# EAGLE schematic front-panel-controller (EAGLE 5.11)

## Sheet 1 of 4
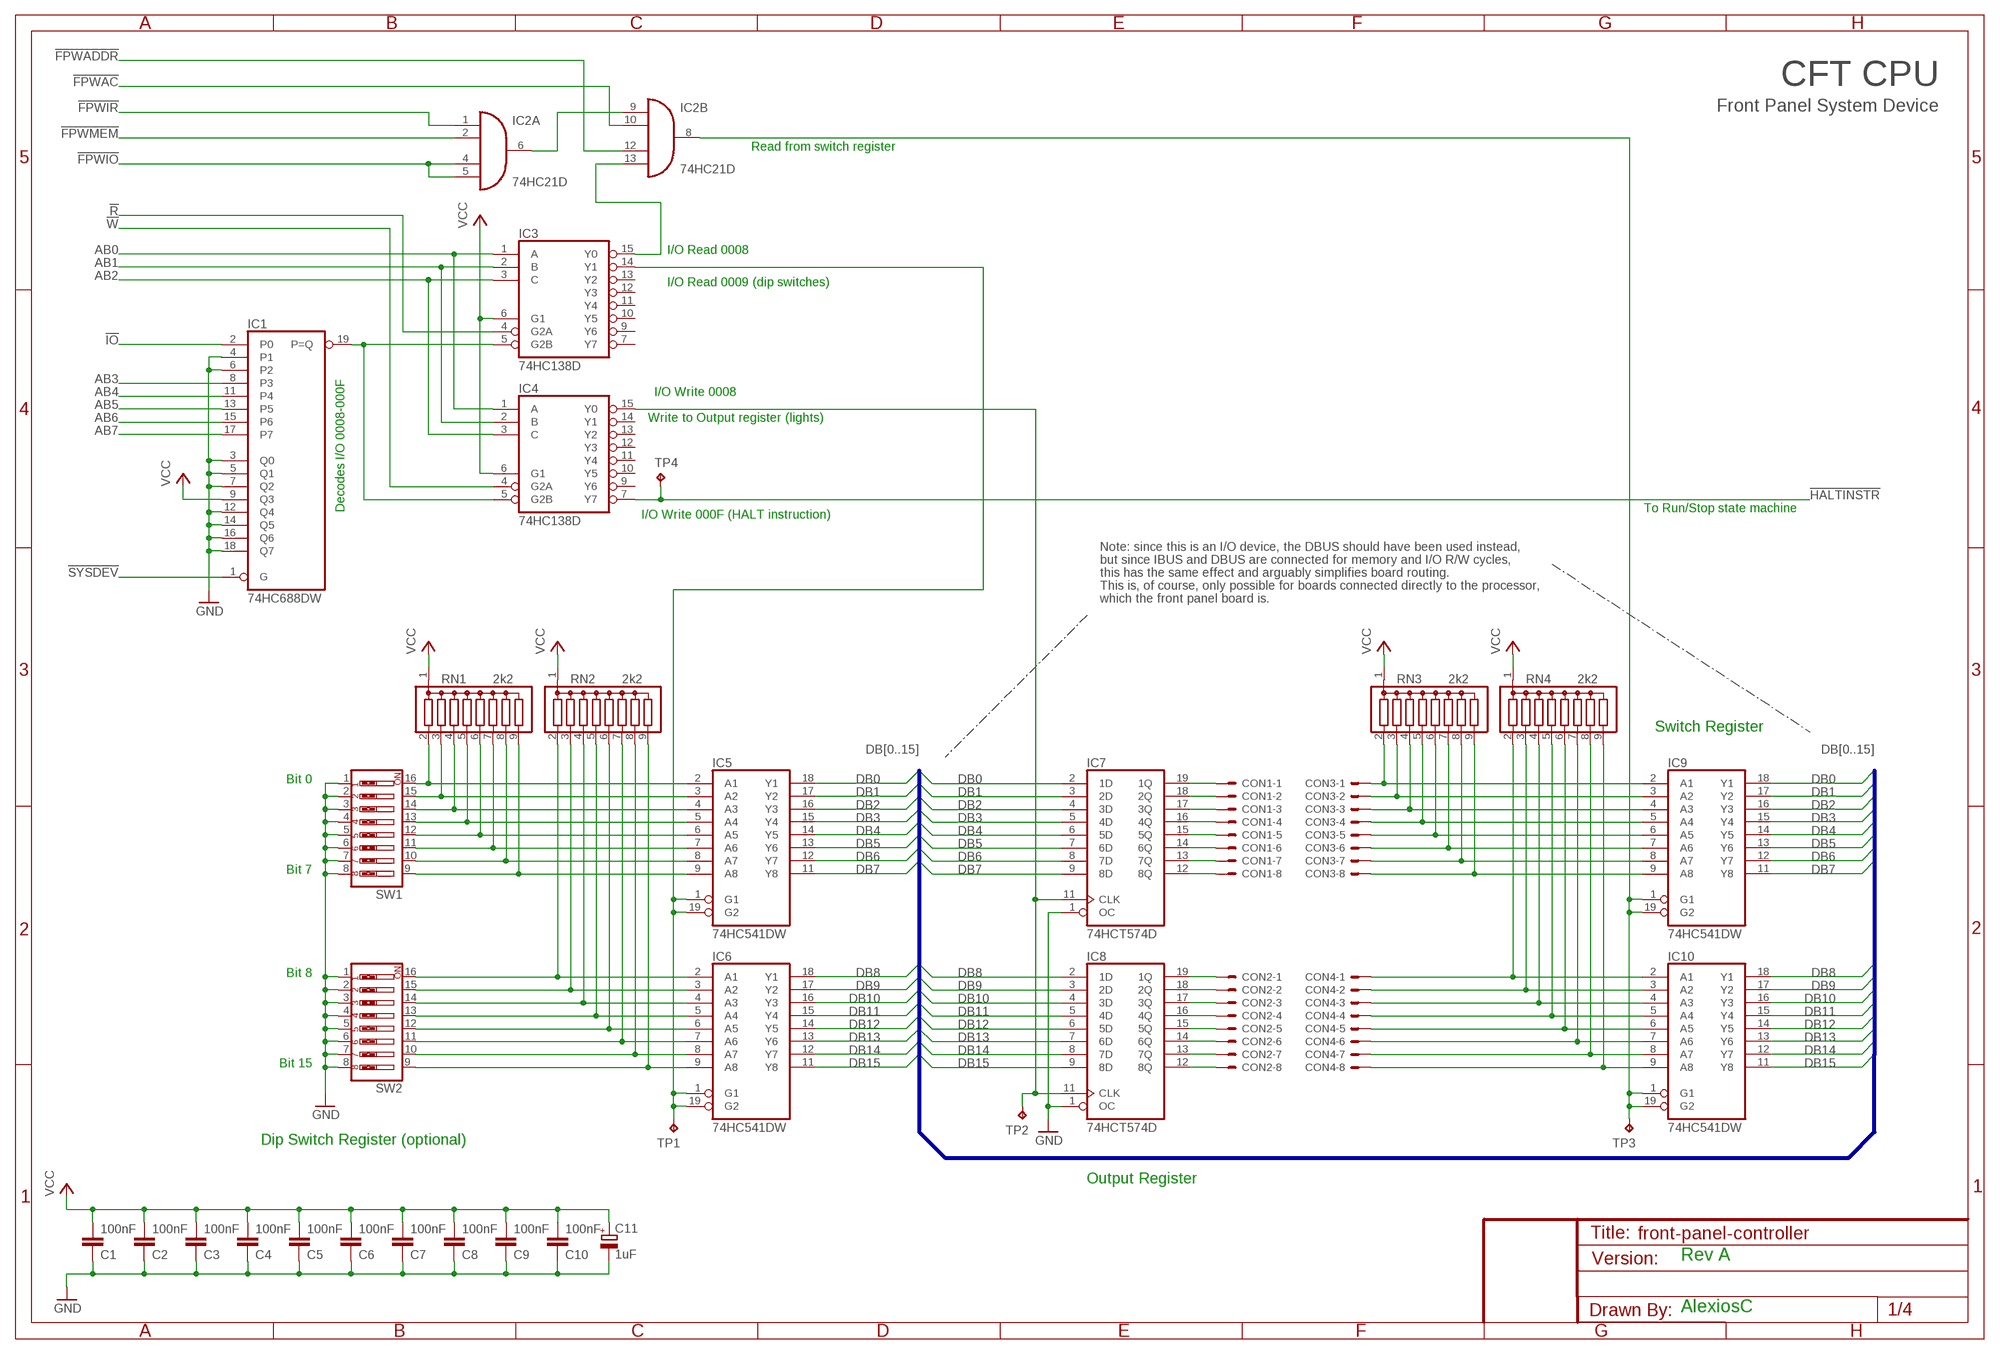
[diagram p0: schematic, sheet 1]

### Parts
C1  100nF  C-EUC0805  [C0805]
C2  100nF  C-EUC0805  [C0805]
C3  100nF  C-EUC0805  [C0805]
C4  100nF  C-EUC0805  [C0805]
C5  100nF  C-EUC0805  [C0805]
C6  100nF  C-EUC0805  [C0805]
C7  100nF  C-EUC0805  [C0805]
C8  100nF  C-EUC0805  [C0805]
C9  100nF  C-EUC0805  [C0805]
C10  100nF  C-EUC0805  [C0805]
C11  1uF  CPOL-EUE2.5-5  [E2,5-5]
CON1  22-23-2081  [22-23-2081]
CON2  22-23-2081  [22-23-2081]
CON3  22-23-2081  [22-23-2081]
CON4  22-23-2081  [22-23-2081]
IC1  74HC688DW  [SO20W]
IC2  74HC21D  [SO14]
IC3  74HC138D  [SO16]
IC4  74HC138D  [SO16]
IC5  74HC541DW  [SO20W]
IC6  74HC541DW  [SO20W]
IC7  74HCT574D  [SO20W]
IC8  74HCT574D  [SO20W]
IC9  74HC541DW  [SO20W]
IC10  74HC541DW  [SO20W]
RN1  2k2  G08R  [SIL9]
RN2  2k2  G08R  [SIL9]
RN3  2k2  G08R  [SIL9]
RN4  2k2  G08R  [SIL9]
SW1  SW_DIP-8  [EDG-08]
SW2  SW_DIP-8  [EDG-08]
TP1  TPPAD1-13  [P1-13]
TP2  TPPAD1-13  [P1-13]
TP3  TPPAD1-13  [P1-13]
TP4  TPPAD1-13  [P1-13]

### Nets
!CLKOREG: IC4.15(Y0) IC7.11(CLK) IC8.11(CLK) TP2.TP
!FPWAC: IC2.10(B:I1) ; also sheet 3,4
!FPWADDR: IC2.12(B:I2) ; also sheet 3,4
!FPWIO: IC2.4(A:I2) IC2.5(A:I3) ; also sheet 3,4
!FPWIR: IC2.1(A:I0) ; also sheet 3,4
!FPWMEM: IC2.2(A:I1) ; also sheet 3,4
!HALTINSTR: IC4.7(Y7) TP4.TP ; also sheet 2
!IO: IC1.2(P0) ; also sheet 3,4
!R: IC3.4(G2A) ; also sheet 3,4
!RDPSW: IC3.14(Y1) IC5.1(G1) IC5.19(G2) IC6.1(G1) IC6.19(G2) TP1.TP
!RSW: IC2.8(B:O) IC9.1(G1) IC9.19(G2) IC10.1(G1) IC10.19(G2) TP3.TP
!SYSDEV: IC1.1(G) ; also sheet 4
!W: IC4.4(G2A) ; also sheet 3,4
AB0: IC3.1(A) IC4.1(A) ; also sheet 4
AB1: IC3.2(B) IC4.2(B) ; also sheet 4
AB2: IC3.3(C) IC4.3(C) ; also sheet 4
AB3: IC1.8(P3) ; also sheet 4
AB4: IC1.11(P4) ; also sheet 4
AB5: IC1.13(P5) ; also sheet 4
AB6: IC1.15(P6) ; also sheet 4
AB7: IC1.17(P7) ; also sheet 4
DB0: IC5.18(Y1) IC7.2(1D) IC9.18(Y1) ; also sheet 4
DB1: IC5.17(Y2) IC7.3(2D) IC9.17(Y2) ; also sheet 4
DB2: IC5.16(Y3) IC7.4(3D) IC9.16(Y3) ; also sheet 4
DB3: IC5.15(Y4) IC7.5(4D) IC9.15(Y4) ; also sheet 4
DB4: IC5.14(Y5) IC7.6(5D) IC9.14(Y5) ; also sheet 4
DB5: IC5.13(Y6) IC7.7(6D) IC9.13(Y6) ; also sheet 4
DB6: IC5.12(Y7) IC7.8(7D) IC9.12(Y7) ; also sheet 4
DB7: IC5.11(Y8) IC7.9(8D) IC9.11(Y8) ; also sheet 4
DB8: IC6.18(Y1) IC8.2(1D) IC10.18(Y1) ; also sheet 4
DB9: IC6.17(Y2) IC8.3(2D) IC10.17(Y2) ; also sheet 4
DB10: IC6.16(Y3) IC8.4(3D) IC10.16(Y3) ; also sheet 4
DB11: IC6.15(Y4) IC8.5(4D) IC10.15(Y4) ; also sheet 4
DB12: IC6.14(Y5) IC8.6(5D) IC10.14(Y5) ; also sheet 4
DB13: IC6.13(Y6) IC8.7(6D) IC10.13(Y6) ; also sheet 4
DB14: IC6.12(Y7) IC8.8(7D) IC10.12(Y7) ; also sheet 4
DB15: IC6.11(Y8) IC8.9(8D) IC10.11(Y8) ; also sheet 4
GND: C1.1 C2.1 C3.1 C4.1 C5.1 C6.1 C7.1 C8.1 C9.1 C10.1 C11.- IC1.3(Q0) IC1.4(P1) IC1.5(Q1) IC1.6(P2) IC1.7(Q2) IC1.12(Q4) IC1.14(Q5) IC1.16(Q6) IC1.18(Q7) IC7.1(OC) IC8.1(OC) SW1.1 SW1.2 SW1.3 SW1.4 SW1.5 SW1.6 SW1.7 SW1.8 SW2.1 SW2.2 SW2.3 SW2.4 SW2.5 SW2.6 SW2.7 SW2.8 ; also sheet 2,3,4
N$1: IC5.2(A1) RN1.2 SW1.16
N$2: IC5.3(A2) RN1.3 SW1.15
N$3: IC5.4(A3) RN1.4 SW1.14
N$4: IC5.5(A4) RN1.5 SW1.13
N$5: IC5.6(A5) RN1.6 SW1.12
N$6: IC5.7(A6) RN1.7 SW1.11
N$7: IC5.8(A7) RN1.8 SW1.10
N$8: IC5.9(A8) RN1.9 SW1.9
N$9: IC6.2(A1) RN2.2 SW2.16
N$10: IC6.3(A2) RN2.3 SW2.15
N$11: IC6.4(A3) RN2.4 SW2.14
N$12: IC6.5(A4) RN2.5 SW2.13
N$13: IC6.6(A5) RN2.6 SW2.12
N$14: IC6.7(A6) RN2.7 SW2.11
N$15: IC6.8(A7) RN2.8 SW2.10
N$16: IC6.9(A8) RN2.9 SW2.9
N$22: CON3.1 IC9.2(A1) RN3.2
N$31: IC1.19(P=Q) IC3.5(G2B) IC4.5(G2B)
N$32: IC2.13(B:I3) IC3.15(Y0)
N$48: IC2.6(A:O) IC2.9(B:I0)
N$49: CON1.1 IC7.19(1Q)
N$50: CON1.2 IC7.18(2Q)
N$51: CON1.3 IC7.17(3Q)
N$52: CON1.4 IC7.16(4Q)
N$53: CON1.5 IC7.15(5Q)
N$54: CON1.6 IC7.14(6Q)
N$56: CON1.7 IC7.13(7Q)
N$62: CON1.8 IC7.12(8Q)
N$63: CON2.1 IC8.19(1Q)
N$64: CON2.2 IC8.18(2Q)
N$65: CON2.3 IC8.17(3Q)
N$66: CON2.4 IC8.16(4Q)
N$67: CON2.5 IC8.15(5Q)
N$68: CON2.6 IC8.14(6Q)
N$69: CON2.7 IC8.13(7Q)
N$70: CON2.8 IC8.12(8Q)
N$71: CON3.2 IC9.3(A2) RN3.3
N$72: CON3.3 IC9.4(A3) RN3.4
N$73: CON3.4 IC9.5(A4) RN3.5
N$74: CON3.5 IC9.6(A5) RN3.6
N$75: CON3.6 IC9.7(A6) RN3.7
N$76: CON3.7 IC9.8(A7) RN3.8
N$78: CON3.8 IC9.9(A8) RN3.9
N$84: CON4.1 IC10.2(A1) RN4.2
N$85: CON4.2 IC10.3(A2) RN4.3
N$86: CON4.3 IC10.4(A3) RN4.4
N$87: CON4.4 IC10.5(A4) RN4.5
N$88: CON4.5 IC10.6(A5) RN4.6
N$89: CON4.6 IC10.7(A6) RN4.7
N$90: CON4.7 IC10.8(A7) RN4.8
N$91: CON4.8 IC10.9(A8) RN4.9
VCC: C1.2 C2.2 C3.2 C4.2 C5.2 C6.2 C7.2 C8.2 C9.2 C10.2 C11.+ IC1.9(Q3) IC3.6(G1) IC4.6(G1) RN1.1 RN2.1 RN3.1 RN4.1 ; also sheet 2,3,4
Unconnected: IC3.7(Y7) IC3.9(Y6) IC3.10(Y5) IC3.11(Y4) IC3.12(Y3) IC3.13(Y2) IC4.9(Y6) IC4.10(Y5) IC4.11(Y4) IC4.12(Y3) IC4.13(Y2) IC4.14(Y1)

### Buses
DB[0..15]

### Notes on the sheet
- CFT CPU
- Front Panel System Device
- Read from switch register
- I/O Read 0008
- I/O Read 0009 (dip switches)
- I/O Write 0008
- Write to Output register (lights)
- Decodes I/O 0008-000F | To Run/Stop state machine
- I/O Write 000F (HALT instruction)
- Note: since this is an I/O device, the DBUS should have been used instead,
- but since IBUS and DBUS are connected for memory and I/O R/W cycles,
- this has the same effect and arguably simplifies board routing.
- This is, of course, only possible for boards connected directly to the processor,
- which the front panel board is.
- Switch Register
- Bit 0
- Bit 7
- Bit 8
- Bit 15
- Dip Switch Register (optional)
- Output Register
- Rev A
- AlexiosC

## Sheet 2 of 4
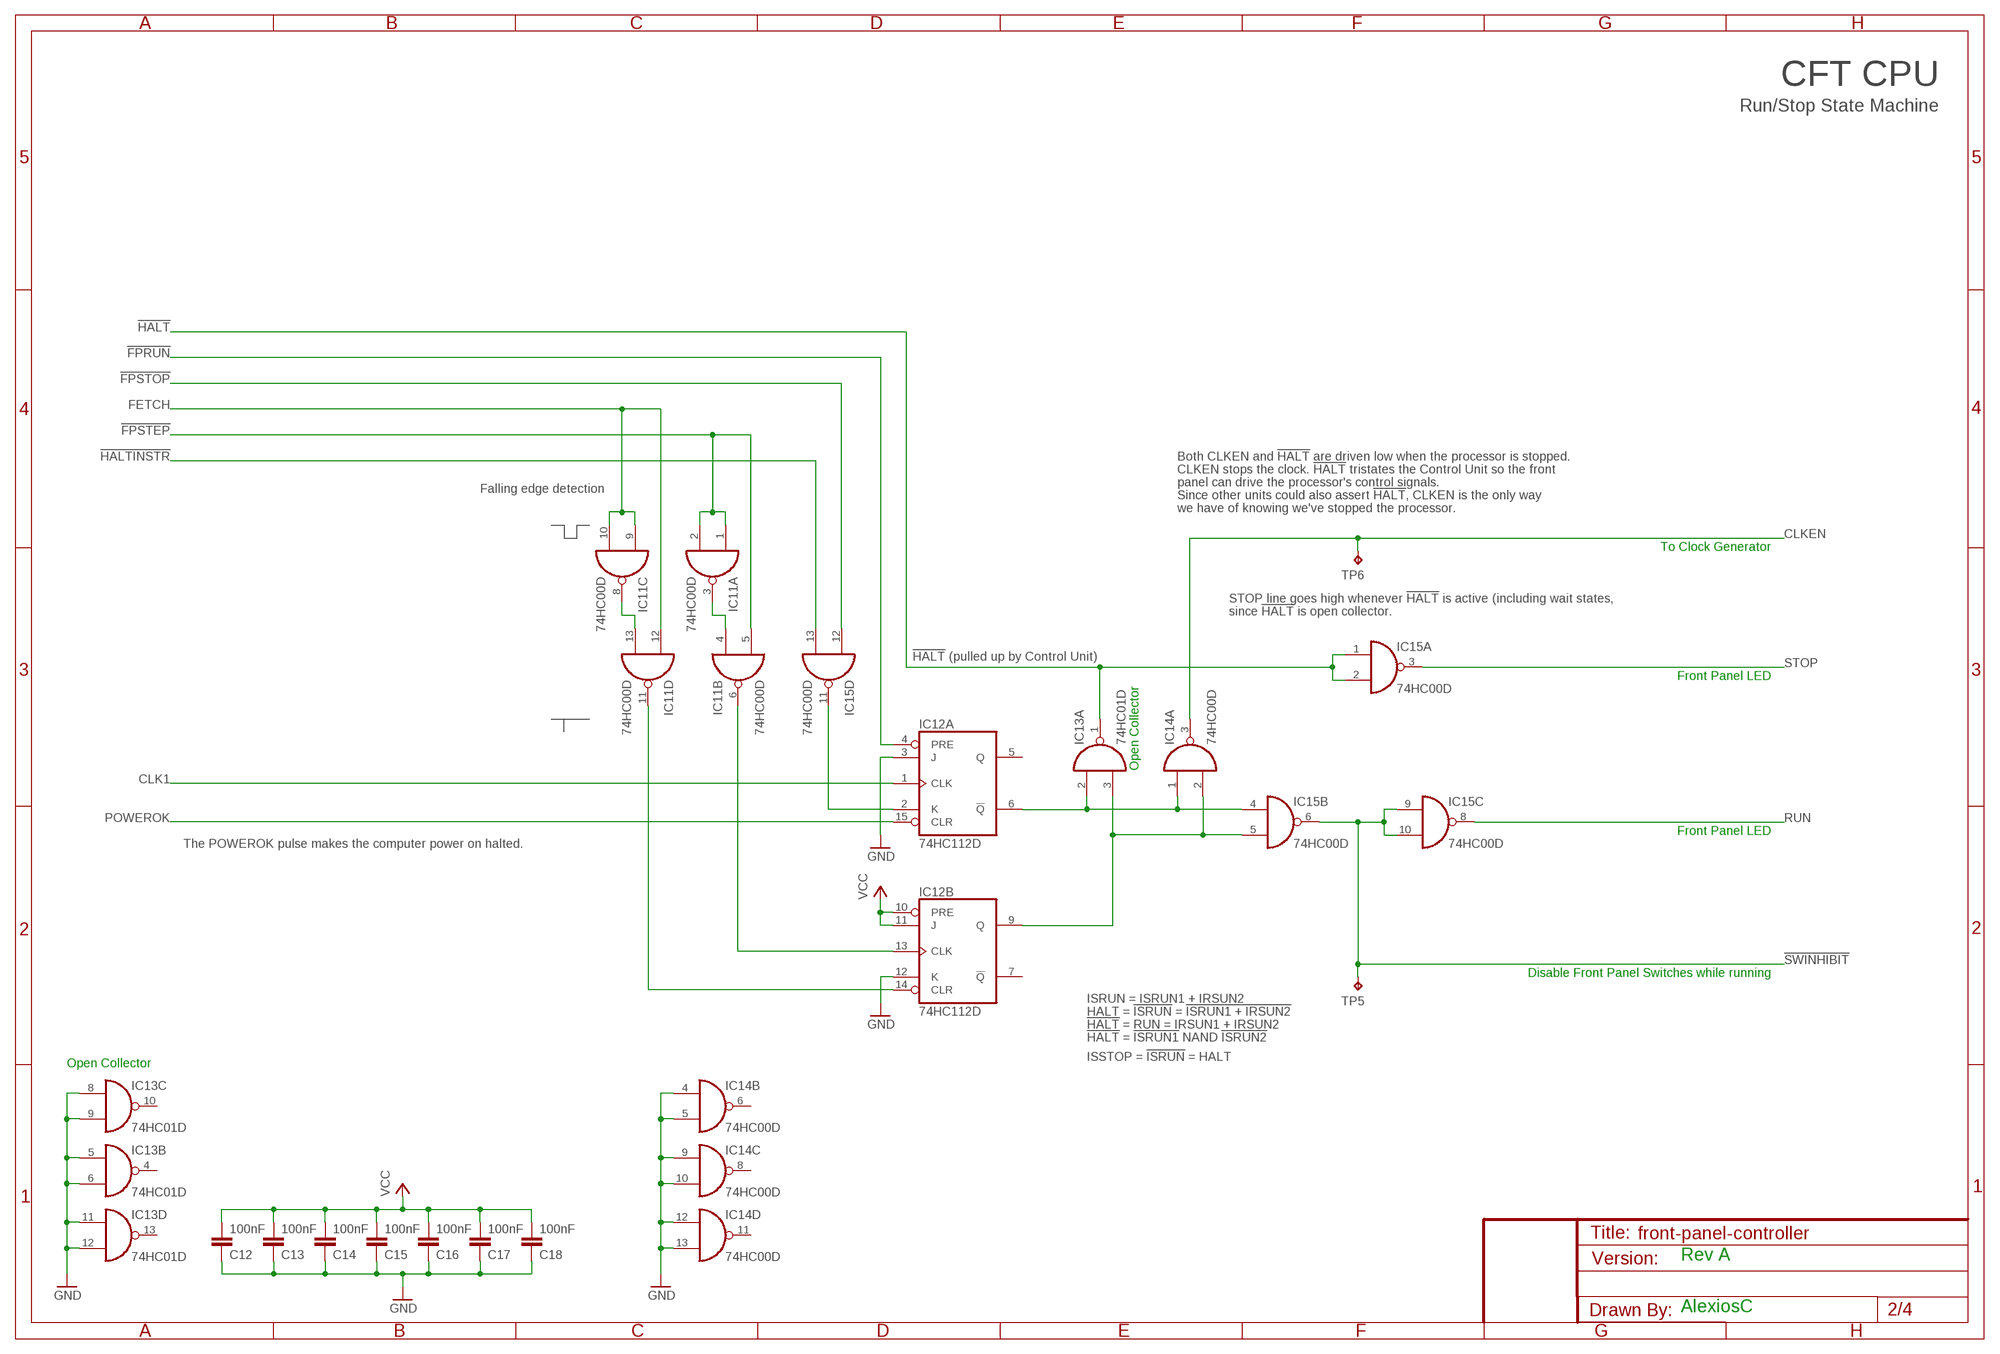
[diagram p1: schematic, sheet 2]

### Parts
C12  100nF  C-EUC0805  [C0805]
C13  100nF  C-EUC0805  [C0805]
C14  100nF  C-EUC0805  [C0805]
C15  100nF  C-EUC0805  [C0805]
C16  100nF  C-EUC0805  [C0805]
C17  100nF  C-EUC0805  [C0805]
C18  100nF  C-EUC0805  [C0805]
IC11  74HC00D  [SO14]
IC12  74HC112D  [SO16]
IC13  74HC01D  [SO14]
IC14  74HC00D  [SO14]
IC15  74HC00D  [SO14]
TP5  TPPAD1-13  [P1-13]
TP6  TPPAD1-13  [P1-13]

### Nets
!FPRUN: IC12.4(A:PRE) ; also sheet 4
!FPSTEP: IC11.1(A:I0) IC11.2(A:I1) IC11.5(B:I1) ; also sheet 4
!FPSTOP: IC15.12(D:I0) ; also sheet 4
!HALT: IC13.1(A:O) IC15.1(A:I0) IC15.2(A:I1) ; also sheet 4
!HALTINSTR: IC15.13(D:I1) ; also sheet 1
!SWINHIBIT: IC15.6(B:O) IC15.9(C:I0) IC15.10(C:I1) TP5.TP ; also sheet 4
CLK1: IC12.1(A:CLK) ; also sheet 4
CLKEN: IC14.3(A:O) TP6.TP ; also sheet 4
FETCH: IC11.9(C:I0) IC11.10(C:I1) IC11.12(D:I0) ; also sheet 4
GND: C12.1 C13.1 C14.1 C15.1 C16.1 C17.1 C18.1 IC12.3(A:J) IC12.12(B:K) IC13.5(B:I0) IC13.6(B:I1) IC13.8(C:I0) IC13.9(C:I1) IC13.11(D:I0) IC13.12(D:I1) IC14.4(B:I0) IC14.5(B:I1) IC14.9(C:I0) IC14.10(C:I1) IC14.12(D:I0) IC14.13(D:I1) ; also sheet 1,3,4
N$39: IC11.3(A:O) IC11.4(B:I0)
N$42: IC11.8(C:O) IC11.13(D:I1)
N$43: IC12.2(A:K) IC15.11(D:O)
N$44: IC11.11(D:O) IC12.14(B:CLR)
N$45: IC12.6(A:!Q) IC13.2(A:I0) IC14.1(A:I0) IC15.4(B:I0)
N$46: IC12.9(B:Q) IC13.3(A:I1) IC14.2(A:I1) IC15.5(B:I1)
N$47: IC11.6(B:O) IC12.13(B:CLK)
POWEROK: IC12.15(A:CLR) ; also sheet 4
RUN: IC15.8(C:O) ; also sheet 3,4
STOP: IC15.3(A:O) ; also sheet 4
VCC: C12.2 C13.2 C14.2 C15.2 C16.2 C17.2 C18.2 IC12.10(B:PRE) IC12.11(B:J) ; also sheet 1,3,4
Unconnected: IC12.5(A:Q) IC12.7(B:!Q) IC13.4(B:O) IC13.10(C:O) IC13.13(D:O) IC14.6(B:O) IC14.8(C:O) IC14.11(D:O)

### Notes on the sheet
- CFT CPU
- Run/Stop State Machine
- Both CLKEN and !HALT! are driven low when the processor is stopped.
- CLKEN stops the clock. !HALT! tristates the Control Unit so the front
- panel can drive the processor's control signals.
- Falling edge detection
- Since other units could also assert !HALT!, CLKEN is the only way
- we have of knowing we've stopped the processor.
- To Clock Generator
- STOP line goes high whenever !HALT! is active (including wait states,
- since !HALT! is open collector.
- !HALT! (pulled up by Control Unit)
- Front Panel LED
- Open Collector
- Front Panel LED
- The POWEROK pulse makes the computer power on halted.
- Disable Front Panel Switches while running
- ISRUN = ISRUN1 + IRSUN2
- HALT = !ISRUN! = !ISRUN1 + IRSUN2!
- !HALT! = RUN = IRSUN1 + IRSUN2
- !HALT! = !ISRUN1! NAND !ISRUN2!
- ISSTOP = !ISRUN! = HALT
- Open Collector
- Rev A
- AlexiosC

## Sheet 3 of 4
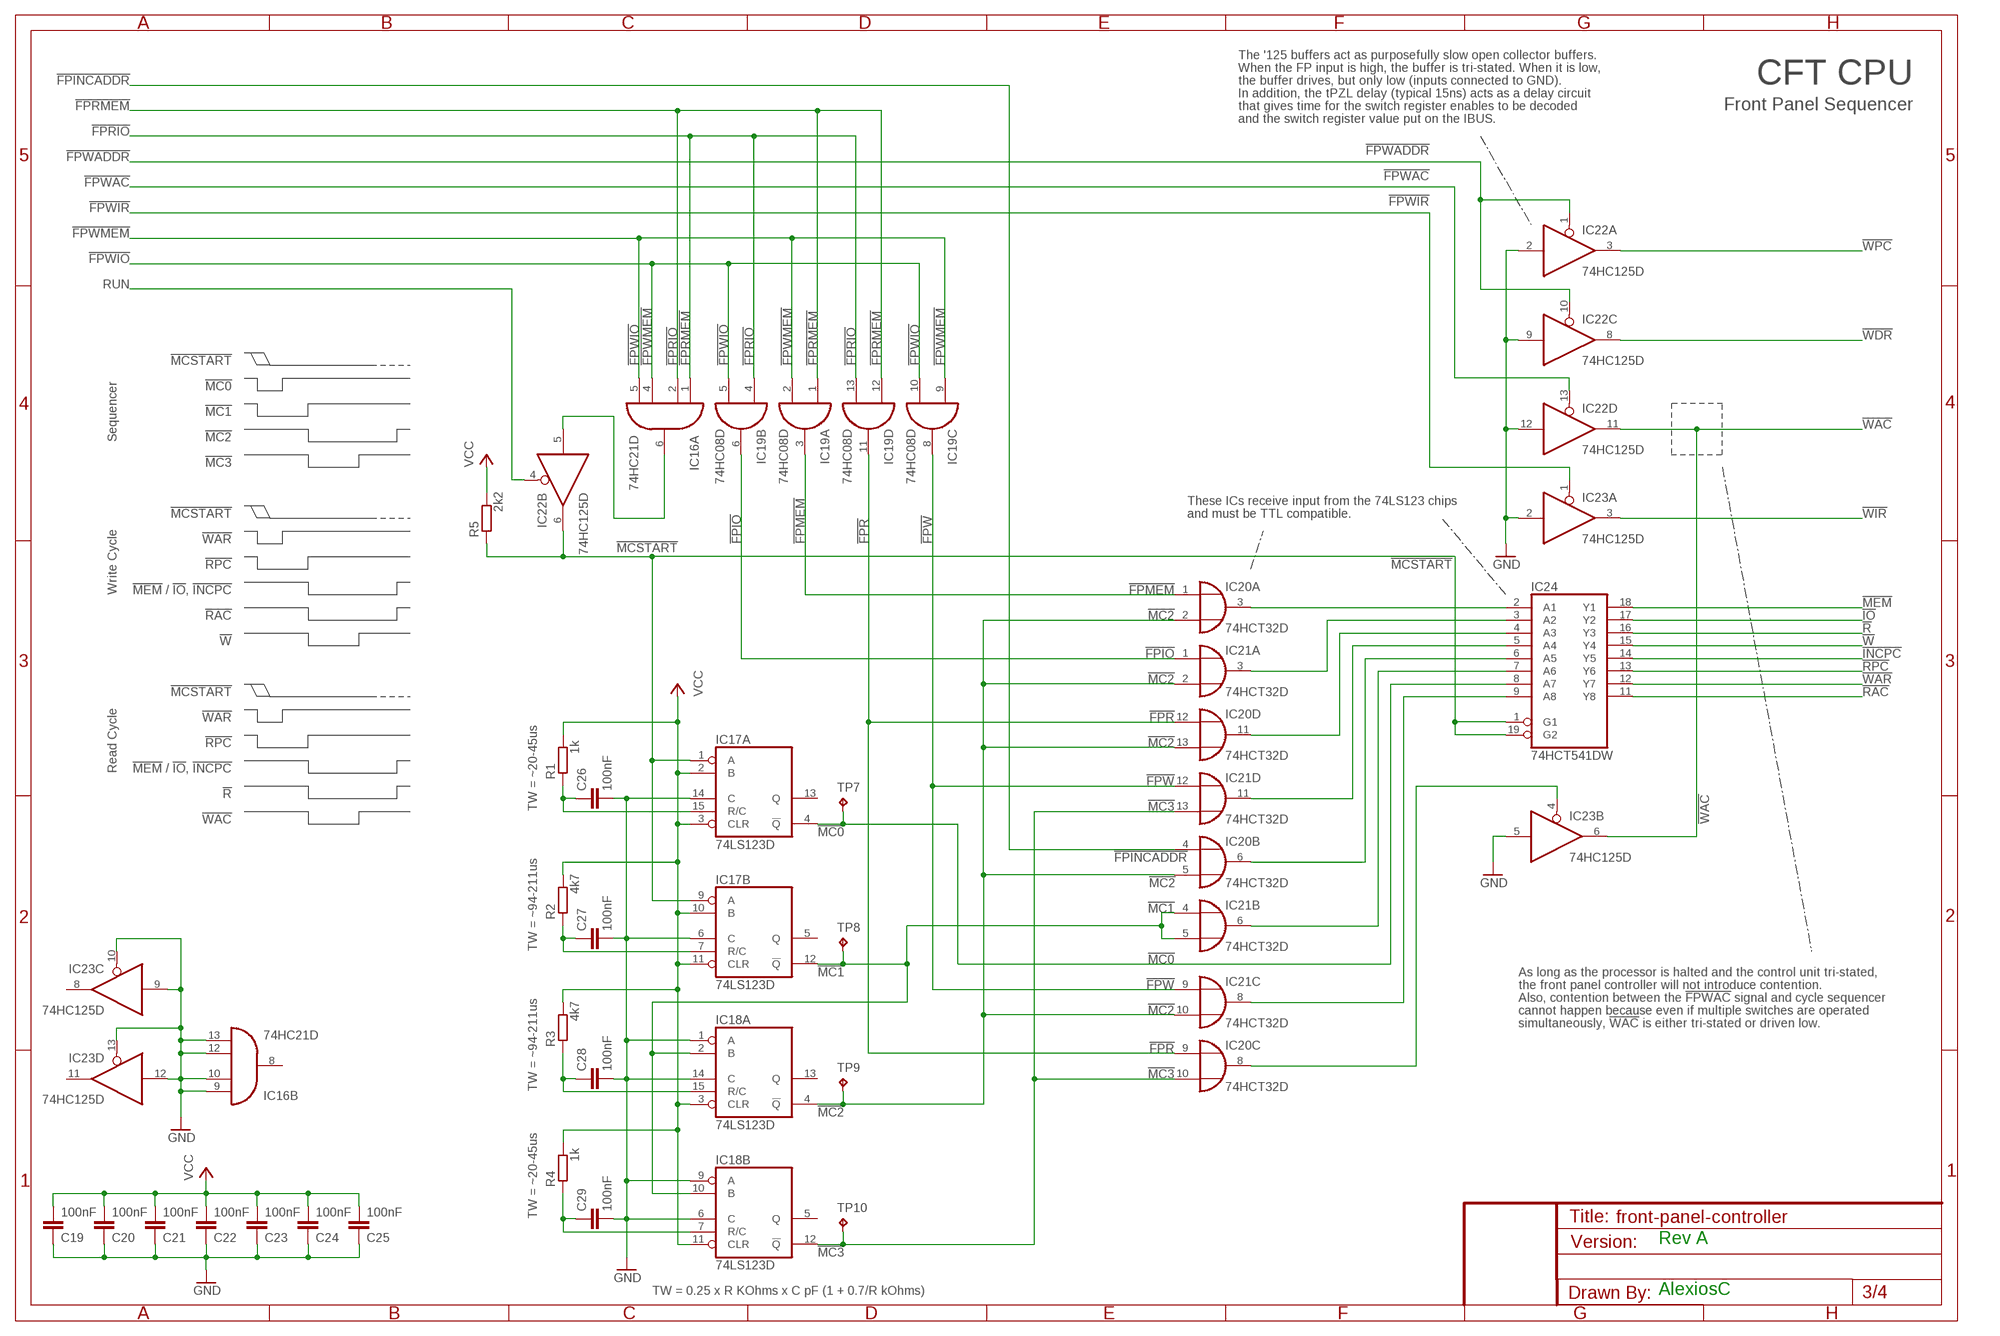
[diagram p2: schematic, sheet 3]

### Parts
C19  100nF  C-EUC0805  [C0805]
C20  100nF  C-EUC0805  [C0805]
C21  100nF  C-EUC0805  [C0805]
C22  100nF  C-EUC0805  [C0805]
C23  100nF  C-EUC0805  [C0805]
C24  100nF  C-EUC0805  [C0805]
C25  100nF  C-EUC0805  [C0805]
C26  100nF  C-EUC0805  [C0805]
C27  100nF  C-EUC0805  [C0805]
C28  100nF  C-EUC0805  [C0805]
C29  100nF  C-EUC0805  [C0805]
IC16  74HC21D  [SO14]
IC17  74LS123D  [SO16]
IC18  74LS123D  [SO16]
IC19  74HC08D  [SO14]
IC20  74HCT32D  [SO14]
IC21  74HCT32D  [SO14]
IC22  74HC125D  [SO14]
IC23  74HC125D  [SO14]
IC24  74HCT541DW  [SO20W]
R1  1k  R-EU_R0805  [R0805]
R2  4k7  R-EU_R0805  [R0805]
R3  4k7  R-EU_R0805  [R0805]
R4  1k  R-EU_R0805  [R0805]
R5  2k2  R-EU_R0805  [R0805]
TP7  TPPAD1-13  [P1-13]
TP8  TPPAD1-13  [P1-13]
TP9  TPPAD1-13  [P1-13]
TP10  TPPAD1-13  [P1-13]

### Nets
!FPINCADDR: IC20.4(B:I0) ; also sheet 4
!FPIO: IC19.6(B:O) IC21.1(A:I0)
!FPMEM: IC19.3(A:O) IC20.1(A:I0)
!FPR: IC19.11(D:O) IC20.9(C:I0) IC20.12(D:I0)
!FPRIO: IC16.1(A:I0) IC19.4(B:I0) IC19.13(D:I1) ; also sheet 4
!FPRMEM: IC16.2(A:I1) IC19.1(A:I0) IC19.12(D:I0) ; also sheet 4
!FPW: IC19.8(C:O) IC21.9(C:I0) IC21.12(D:I0)
!FPWAC: IC22.13(D:OE) ; also sheet 1,4
!FPWADDR: IC22.1(A:OE) IC22.10(C:OE) ; also sheet 1,4
!FPWIO: IC16.4(A:I2) IC19.5(B:I1) IC19.10(C:I1) ; also sheet 1,4
!FPWIR: IC23.1(A:OE) ; also sheet 1,4
!FPWMEM: IC16.5(A:I3) IC19.2(A:I1) IC19.9(C:I0) ; also sheet 1,4
!INCPC: IC24.14(Y5) ; also sheet 4
!IO: IC24.17(Y2) ; also sheet 1,4
!MC0: IC17.4(A:!Q) IC24.8(A7) TP7.TP
!MC1: IC17.12(B:!Q) IC18.2(A:B) IC18.10(B:B) IC21.4(B:I0) IC21.5(B:I1) TP8.TP
!MC2: IC18.4(A:!Q) IC20.2(A:I1) IC20.5(B:I1) IC20.13(D:I1) IC21.2(A:I1) IC21.10(C:I1) TP9.TP
!MC3: IC18.12(B:!Q) IC20.10(C:I1) IC21.13(D:I1) TP10.TP
!MCSTART: IC17.1(A:A) IC17.9(B:A) IC22.6(B:O) IC24.1(G1) IC24.19(G2) R5.1
!MEM: IC24.18(Y1) ; also sheet 4
!R: IC24.16(Y3) ; also sheet 1,4
!RAC: IC24.11(Y8) ; also sheet 4
!RPC: IC24.13(Y6) ; also sheet 4
!W: IC24.15(Y4) ; also sheet 1,4
!WAC: IC22.11(D:O) IC23.6(B:O) ; also sheet 4
!WAR: IC24.12(Y7) ; also sheet 4
!WDR: IC22.8(C:O) ; also sheet 4
!WIR: IC23.3(A:O) ; also sheet 4
!WPC: IC22.3(A:O) ; also sheet 4
GND: C19.1 C20.1 C21.1 C22.1 C23.1 C24.1 C25.1 C26.2 C27.2 C28.2 C29.2 IC16.9(B:I0) IC16.10(B:I1) IC16.12(B:I2) IC16.13(B:I3) IC17.6(B:C) IC17.14(A:C) IC18.1(A:A) IC18.6(B:C) IC18.9(B:A) IC18.14(A:C) IC22.2(A:I) IC22.9(C:I) IC22.12(D:I) IC23.2(A:I) IC23.5(B:I) IC23.9(C:I) IC23.10(C:OE) IC23.12(D:I) IC23.13(D:OE) ; also sheet 1,2,4
N$17: IC20.8(C:O) IC23.4(B:OE)
N$18: IC16.6(A:O) IC22.5(B:I)
N$59: C26.1 IC17.15(A:R/C) R1.1
N$77: IC21.8(C:O) IC24.9(A8)
N$79: C27.1 IC17.7(B:R/C) R2.1
N$80: C28.1 IC18.15(A:R/C) R3.1
N$81: C29.1 IC18.7(B:R/C) R4.1
N$83: IC20.3(A:O) IC24.2(A1)
N$316: IC20.11(D:O) IC24.4(A3)
N$317: IC21.11(D:O) IC24.5(A4)
N$318: IC20.6(B:O) IC24.6(A5)
N$319: IC21.6(B:O) IC24.7(A6)
N$321: IC21.3(A:O) IC24.3(A2)
RUN: IC22.4(B:OE) ; also sheet 2,4
VCC: C19.2 C20.2 C21.2 C22.2 C23.2 C24.2 C25.2 IC17.2(A:B) IC17.3(A:CLR) IC17.10(B:B) IC17.11(B:CLR) IC18.3(A:CLR) IC18.11(B:CLR) R1.2 R2.2 R3.2 R4.2 R5.2 ; also sheet 1,2,4
Unconnected: IC16.8(B:O) IC17.5(B:Q) IC17.13(A:Q) IC18.5(B:Q) IC18.13(A:Q) IC23.8(C:O) IC23.11(D:O)

### Notes on the sheet
- The '125 buffers act as purposefully slow open collector buffers.
- When the FP input is high, the buffer is tri-stated. When it is low,
- the buffer drives, but only low (inputs connected to GND). | CFT CPU
- In addition, the tPZL delay (typical 15ns) acts as a delay circuit
- that gives time for the switch register enables to be decoded | Front Panel Sequencer
- and the switch register value put on the IBUS.
- Sequencer
- These ICs receive input from the 74LS123 chips
- and must be TTL compatible.
- !WAR
- !RPC
- Write Cycle | !MEM! / !IO!, !INCPC!
- !RAC
- !W
- !WAR
- !RPC
- Read Cycle | !MEM! / !IO!, !INCPC!
- !R
- TW = ~20-45us
- !WAC
- TW = ~94-211us
- As long as the processor is halted and the control unit tri-stated,
- the front panel controller will not introduce contention.
- Also, contention between the !FPWAC! signal and cycle sequencer
- cannot happen because even if multiple switches are operated
- simultaneously, !WAC! is either tri-stated or driven low.
- TW = ~94-211us
- TW = ~20-45us
- Rev A
- TW = 0.25 x R KOhms x C pF (1 + 0.7/R kOhms) | AlexiosC

## Sheet 4 of 4
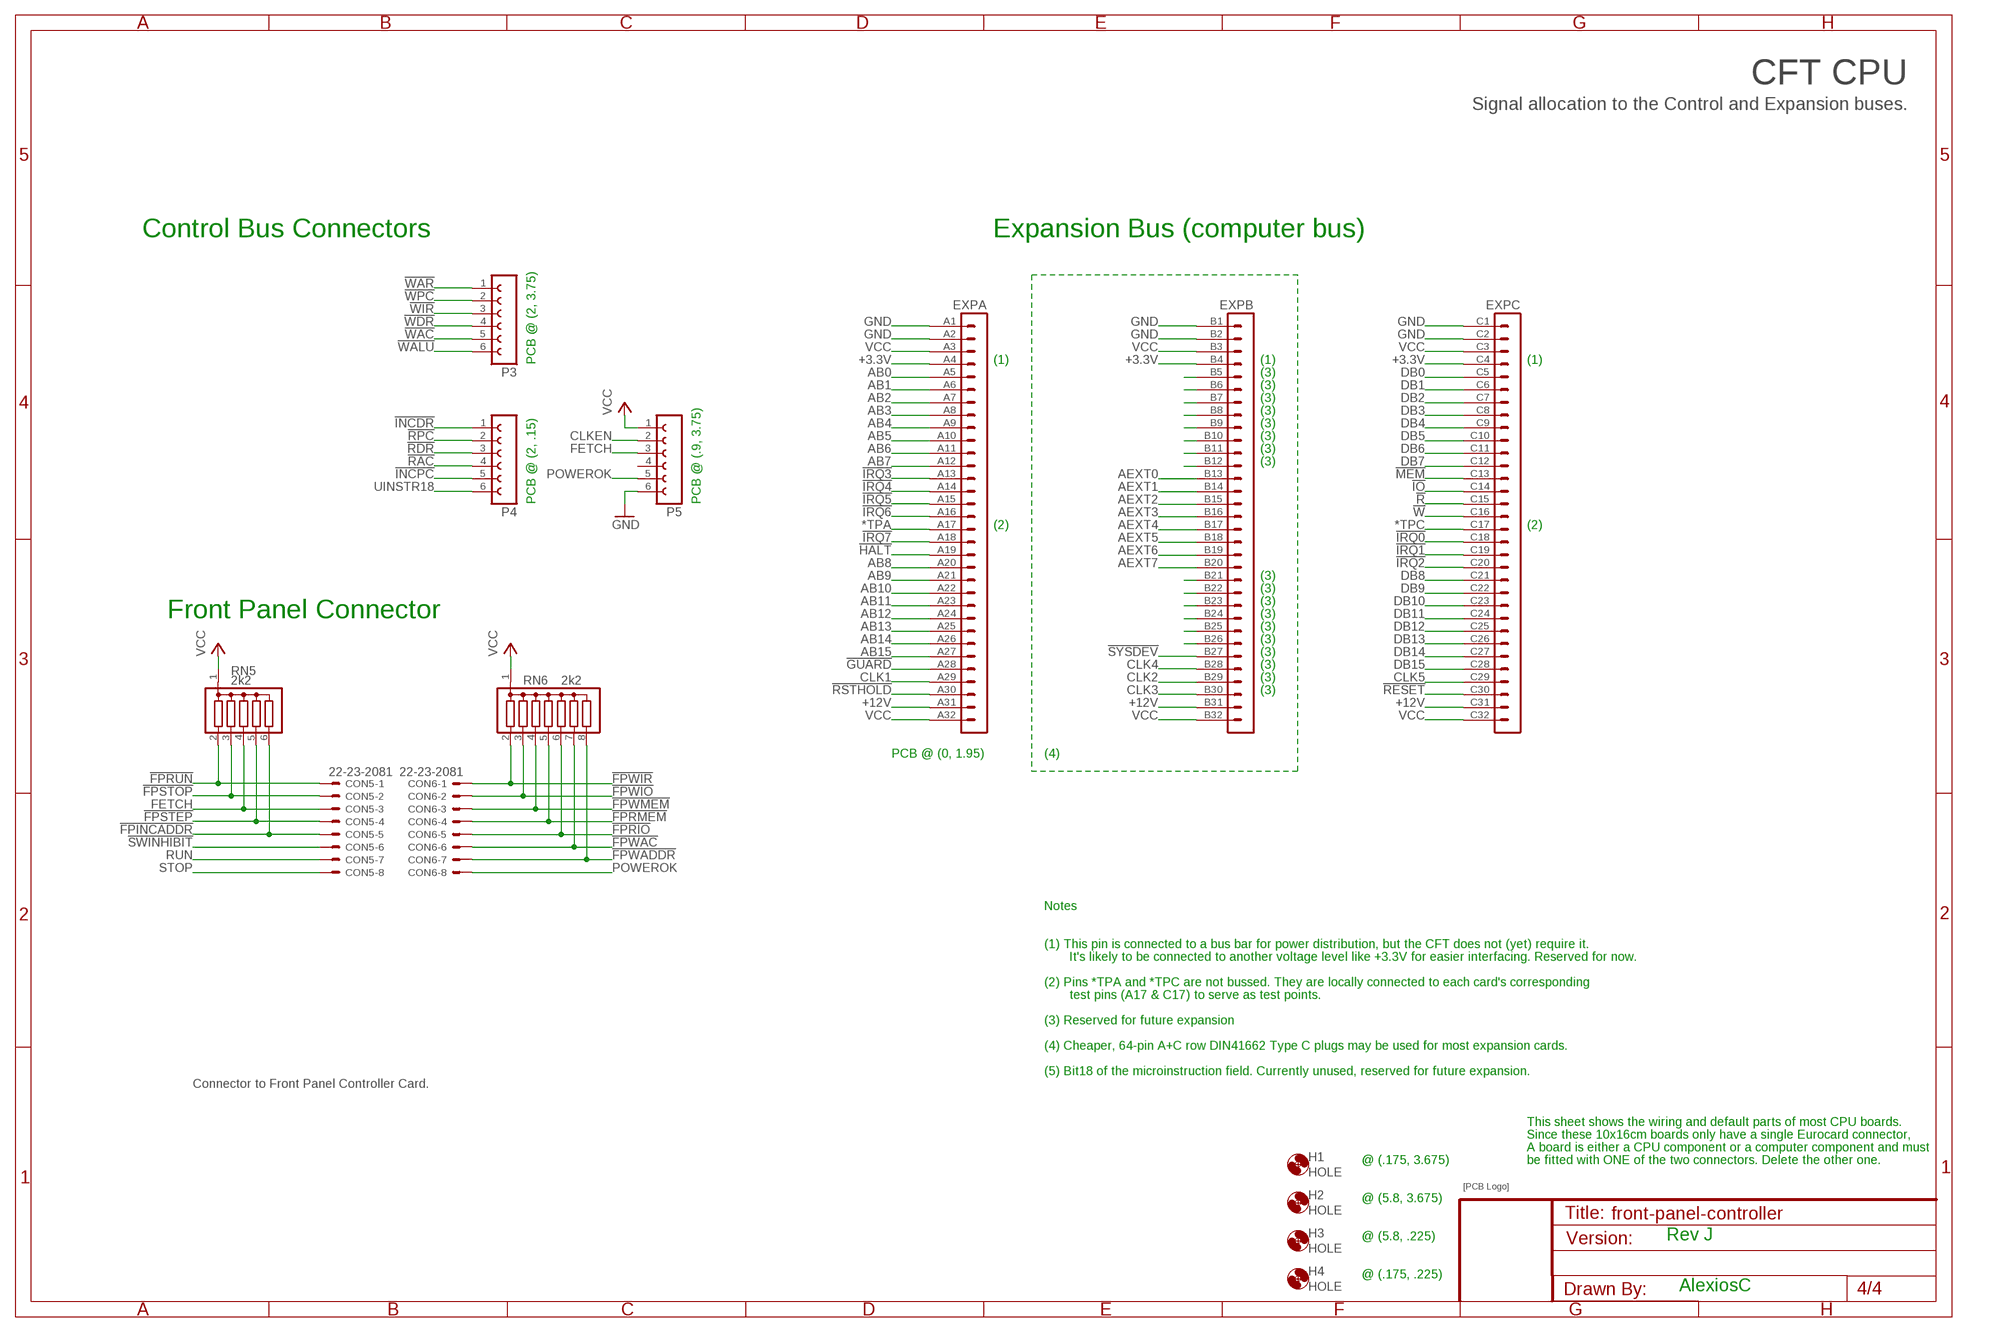
[diagram p3: schematic, sheet 4]

### Parts
CON5  22-23-2081  [22-23-2081]
CON6  22-23-2081  [22-23-2081]
EXP  VG96-3K  [VG96K]
H1  HOLE  [STANDOFF_28_60]
H2  HOLE  [STANDOFF_28_60]
H3  HOLE  [STANDOFF_28_60]
H4  HOLE  [STANDOFF_28_60]
P3  FE06-1  [FE06]
P4  FE06-1  [FE06]
P5  FE06-1  [FE06]
RN5  2k2  G05R  [SIL6]
RN6  2k2  G07R  [SIL8]
U$1  SIGNATURESILK  [SIGNATURE]

### Nets
!FPINCADDR: CON5.5 RN5.6 ; also sheet 3
!FPRIO: CON6.5 RN6.6 ; also sheet 3
!FPRMEM: CON6.4 RN6.5 ; also sheet 3
!FPRUN: CON5.1 RN5.2 ; also sheet 2
!FPSTEP: CON5.4 RN5.5 ; also sheet 2
!FPSTOP: CON5.2 RN5.3 ; also sheet 2
!FPWAC: CON6.6 RN6.7 ; also sheet 1,3
!FPWADDR: CON6.7 RN6.8 ; also sheet 1,3
!FPWIO: CON6.2 RN6.3 ; also sheet 1,3
!FPWIR: CON6.1 RN6.2 ; also sheet 1,3
!FPWMEM: CON6.3 RN6.4 ; also sheet 1,3
!GUARD: EXP.A28
!HALT: EXP.A19 ; also sheet 2
!INCDR: P4.1
!INCPC: P4.5 ; also sheet 3
!IO: EXP.C14 ; also sheet 1,3
!IRQ0: EXP.C18
!IRQ1: EXP.C19
!IRQ2: EXP.C20
!IRQ3: EXP.A13
!IRQ4: EXP.A14
!IRQ5: EXP.A15
!IRQ6: EXP.A16
!IRQ7: EXP.A18
!MEM: EXP.C13 ; also sheet 3
!R: EXP.C15 ; also sheet 1,3
!RAC: P4.4 ; also sheet 3
!RDR: P4.3
!RESET: EXP.C30
!RPC: P4.2 ; also sheet 3
!RSTHOLD: EXP.A30
!SWINHIBIT: CON5.6 ; also sheet 2
!SYSDEV: EXP.B27 ; also sheet 1
!W: EXP.C16 ; also sheet 1,3
!WAC: P3.5 ; also sheet 3
!WALU: P3.6
!WAR: P3.1 ; also sheet 3
!WDR: P3.4 ; also sheet 3
!WIR: P3.3 ; also sheet 3
!WPC: P3.2 ; also sheet 3
*TPA: EXP.A17
*TPC: EXP.C17
+3.3V: EXP.A4 EXP.B4 EXP.C4
+12V [12V]: EXP.A31 EXP.B31 EXP.C31
AB0: EXP.A5 ; also sheet 1
AB1: EXP.A6 ; also sheet 1
AB2: EXP.A7 ; also sheet 1
AB3: EXP.A8 ; also sheet 1
AB4: EXP.A9 ; also sheet 1
AB5: EXP.A10 ; also sheet 1
AB6: EXP.A11 ; also sheet 1
AB7: EXP.A12 ; also sheet 1
AB8: EXP.A20
AB9: EXP.A21
AB10: EXP.A22
AB11: EXP.A23
AB12: EXP.A24
AB13: EXP.A25
AB14: EXP.A26
AB15: EXP.A27
AEXT0: EXP.B13
AEXT1: EXP.B14
AEXT2: EXP.B15
AEXT3: EXP.B16
AEXT4: EXP.B17
AEXT5: EXP.B18
AEXT6: EXP.B19
AEXT7: EXP.B20
CLK1: EXP.A29 ; also sheet 2
CLK2: EXP.B29
CLK3: EXP.B30
CLK4: EXP.B28
CLK5: EXP.C29
CLKEN: P5.2 ; also sheet 2
DB0: EXP.C5 ; also sheet 1
DB1: EXP.C6 ; also sheet 1
DB2: EXP.C7 ; also sheet 1
DB3: EXP.C8 ; also sheet 1
DB4: EXP.C9 ; also sheet 1
DB5: EXP.C10 ; also sheet 1
DB6: EXP.C11 ; also sheet 1
DB7: EXP.C12 ; also sheet 1
DB8: EXP.C21 ; also sheet 1
DB9: EXP.C22 ; also sheet 1
DB10: EXP.C23 ; also sheet 1
DB11: EXP.C24 ; also sheet 1
DB12: EXP.C25 ; also sheet 1
DB13: EXP.C26 ; also sheet 1
DB14: EXP.C27 ; also sheet 1
DB15: EXP.C28 ; also sheet 1
FETCH: CON5.3 P5.3 RN5.4 ; also sheet 2
GND: EXP.A1 EXP.A2 EXP.B1 EXP.B2 EXP.C1 EXP.C2 P5.6 ; also sheet 1,2,3
N$23: EXP.B12
N$24: EXP.B11
N$25: EXP.B10
N$26: EXP.B9
N$27: EXP.B8
N$28: EXP.B7
N$29: EXP.B6
N$30: EXP.B5
N$33: EXP.B26
N$34: EXP.B25
N$35: EXP.B24
N$36: EXP.B23
N$37: EXP.B22
N$38: EXP.B21
POWEROK: CON6.8 P5.5 ; also sheet 2
RUN: CON5.7 ; also sheet 2,3
STOP: CON5.8 ; also sheet 2
UINSTR18: P4.6
VCC: EXP.A3 EXP.A32 EXP.B3 EXP.B32 EXP.C3 EXP.C32 P5.1 RN5.1 RN6.1 ; also sheet 1,2,3
Unconnected: P5.4

### Notes on the sheet
- CFT CPU
- Signal allocation to the Control and Expansion buses.
- Control Bus Connectors | Expansion Bus (computer bus)
- PCB @ (2, 3.75) | (1) | (1) | (1)
- (3)
- (3)
- (3)
- (3)
- (3)
- (3)
- (3)
- (3)
- PCB @ (2, .15) | PCB @ (.9, 3.75)
- (2) | (2)
- (3)
- (3)
- (3)
- Front Panel Connector | (3)
- (3)
- (3)
- (3)
- (3)
- (3)
- (3)
- PCB @ (0, 1.95) | (4)
- Notes
- (1) This pin is connected to a bus bar for power distribution, but the CFT does not (yet) require it.
- It's likely to be connected to another voltage level like +3.3V for easier interfacing. Reserved for now.
- (2) Pins *TPA and *TPC are not bussed. They are locally connected to each card's corresponding
- test pins (A17 & C17) to serve as test points.
- (3) Reserved for future expansion
- (4) Cheaper, 64-pin A+C row DIN41662 Type C plugs may be used for most expansion cards.
- (5) Bit18 of the microinstruction field. Currently unused, reserved for future expansion.
- Connector to Front Panel Controller Card.
- This sheet shows the wiring and default parts of most CPU boards.
- Since these 10x16cm boards only have a single Eurocard connector,
- A board is either a CPU component or a computer component and must
- @ (.175, 3.675) | be fitted with ONE of the two connectors. Delete the other one.
- @ (5.8, 3.675)
- @ (5.8, .225) | Rev J
- @ (.175, .225)
- AlexiosC

## Power pins joined to a net without a drawn wire
GND: IC1.10(GND) IC2.7(P:GND) IC3.8(GND) IC4.8(GND) IC5.10(GND) IC6.10(GND) IC7.10(GND) IC8.10(GND) IC9.10(GND) IC10.10(GND) IC11.7(P:GND) IC12.8(P:GND) IC13.7(P:GND) IC14.7(P:GND) IC15.7(P:GND) IC16.7(P:GND) IC17.8(P:GND) IC18.8(P:GND) IC19.7(P:GND) IC20.7(P:GND) IC21.7(P:GND) IC22.7(P:GND) IC23.7(P:GND) IC24.10(GND)
VCC: IC1.20(VCC) IC2.14(P:VCC) IC3.16(VCC) IC4.16(VCC) IC5.20(VCC) IC6.20(VCC) IC7.20(VCC) IC8.20(VCC) IC9.20(VCC) IC10.20(VCC) IC11.14(P:VCC) IC12.16(P:VCC) IC13.14(P:VCC) IC14.14(P:VCC) IC15.14(P:VCC) IC16.14(P:VCC) IC17.16(P:VCC) IC18.16(P:VCC) IC19.14(P:VCC) IC20.14(P:VCC) IC21.14(P:VCC) IC22.14(P:VCC) IC23.14(P:VCC) IC24.20(VCC)

## Library data of the parts
C1-C10 C12 C13 C19 C21 = resistor:C-EU: CAPACITOR, European symbol
C11 = rcl:CPOL-EU: POLARIZED CAPACITOR, European symbol
C14-C18 C20 C22-C29 = rcl:C-EU: CAPACITOR, European symbol
CON1-CON6 = con-molex:22-23-2081: .100" (2.54mm) Center Header - 8 Pin; MF: MOLEX; MPN: 22-23-2081; OC_FARNELL: 1756826; OC_NEWARK: 01C7592
EXP = alexios-19inch:VG96-3: PCB EUROCARD, 96-pin type C/ABC, 2.54 mm
H1-H4 = alexios:HOLE: Hole for a standoff or mount. Hole diameter: 3.3mm. External Diameter: 6mm.
IC1 = 74xx-eu:74*688: 8-bit MAGNITUDE/IDENTITY COMPARATOR, totem pole
IC2 IC16 = 74xx-eu:74*21: Dual 4-input AND gate
IC3 IC4 = 74xx-eu:74*138: 3-line to 8-line DECODER/DEMULTIPLEXER
IC5 IC6 IC9 IC10 IC24 = 74xx-eu:74*541: Octal BUFFER and LINE DRIVER, 3-state
IC7 IC8 = 74xx-eu:74*574: 8-bit D type FLIP FLOP bus driver
IC11 IC14 IC15 = 74xx-eu:74*00: Quad 2-input NAND gate
IC12 = 74xx-eu:74*112: Dual J-K negative edge triggered FLIP FLOP, preset and clear
IC13 = 74xx-eu:74*01: Quad 2-input NAND gate, open collector
IC17 IC18 = 74xx-eu:74*123: Retriggerable monostable MULTIVIBRATOR
IC19 = 74xx-eu:74*08: Quad 2-input AND gate
IC20 IC21 = 74xx-eu:74*32: Quad 2-input OR gate
IC22 IC23 = 74xx-eu:74*125: Quad bus BUFFER, 3-state
P3-P5 = con-lsta:FE06-1: FEMALE HEADER; OC_FARNELL: unknown; OC_NEWARK: unknown
R1-R5 = rcl:R-EU_: RESISTOR, European symbol
RN1-RN4 = resistor-sil:G08R: SIL RESISTOR; OC_FARNELL: unknown; OC_NEWARK: unknown
RN5 = resistor-sil:G05R: SIL RESISTOR; OC_FARNELL: unknown; OC_NEWARK: unknown
RN6 = resistor-sil:G07R: SIL RESISTOR; OC_FARNELL: unknown; OC_NEWARK: unknown
SW1 SW2 = special:SW_DIP-8: DIP SWITCH
TP1-TP10 = testpad:TP: Test pad
U$1 = alexios:SIGNATURE: Soup signature

## Net classes
0 default: width 0.305 mm, clearance 0.254 mm
1 Power: width 0.635 mm, clearance 0.254 mm
2 12V: width 0.635 mm, clearance 0.635 mm